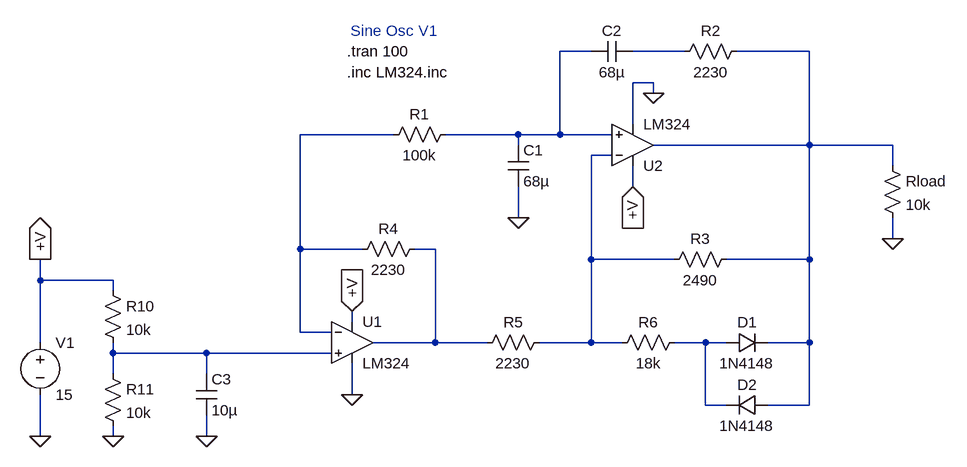
[diagram p0: schematic Sine_Osc_v1.asc]
Sine_Osc_v1.asc, the LTspice schematic file:
Version 4
SHEET 1 880 680
WIRE 144 -400 96 -400
WIRE 288 -400 208 -400
WIRE 480 -400 368 -400
WIRE 240 -352 208 -352
WIRE 240 -336 240 -352
WIRE 208 -288 208 -352
WIRE -160 -272 -304 -272
WIRE 32 -272 -80 -272
WIRE 96 -272 96 -400
WIRE 96 -272 32 -272
WIRE 176 -272 96 -272
WIRE 32 -256 32 -272
WIRE 480 -256 480 -400
WIRE 480 -256 240 -256
WIRE 608 -256 480 -256
WIRE 176 -240 144 -240
WIRE 608 -224 608 -256
WIRE 208 -192 208 -224
WIRE 32 -144 32 -192
WIRE 608 -112 608 -144
WIRE -304 -96 -304 -272
WIRE -208 -96 -304 -96
WIRE -96 -96 -128 -96
WIRE 144 -80 144 -240
WIRE 272 -80 144 -80
WIRE 480 -80 480 -256
WIRE 480 -80 352 -80
WIRE -704 -48 -704 -80
WIRE -592 -48 -704 -48
WIRE -592 -32 -592 -48
WIRE -224 16 -224 0
WIRE -304 32 -304 -96
WIRE -256 32 -304 32
WIRE -704 48 -704 -48
WIRE -96 48 -96 -96
WIRE -96 48 -192 48
WIRE -16 48 -96 48
WIRE 144 48 144 -80
WIRE 144 48 64 48
WIRE 192 48 144 48
WIRE 320 48 272 48
WIRE 352 48 320 48
WIRE 480 48 480 -80
WIRE 480 48 416 48
WIRE -592 64 -592 48
WIRE -448 64 -592 64
WIRE -256 64 -448 64
WIRE -592 96 -592 64
WIRE -448 96 -448 64
WIRE -224 128 -224 80
WIRE 320 144 320 48
WIRE 352 144 320 144
WIRE 480 144 480 48
WIRE 480 144 416 144
WIRE -704 192 -704 128
WIRE -592 192 -592 176
WIRE -448 192 -448 160
FLAG -704 192 0
FLAG -704 -80 +V
IOPIN -704 -80 Out
FLAG -224 0 +V
IOPIN -224 0 In
FLAG -592 192 0
FLAG -224 128 0
FLAG 32 -144 0
FLAG 208 -192 +V
IOPIN 208 -192 In
FLAG 240 -336 0
FLAG 608 -112 0
FLAG -448 192 0
SYMBOL voltage -704 32 R0
WINDOW 123 0 0 Left 2
WINDOW 39 0 0 Left 2
SYMATTR InstName V1
SYMATTR Value 15
SYMBOL res -32 64 R270
WINDOW 0 32 56 VTop 2
WINDOW 3 0 56 VBottom 2
SYMATTR InstName R5
SYMATTR Value 2230
SYMBOL res -112 -112 R90
WINDOW 0 0 56 VBottom 2
WINDOW 3 32 56 VTop 2
SYMATTR InstName R4
SYMATTR Value 2230
SYMBOL res 288 32 R90
WINDOW 0 0 56 VBottom 2
WINDOW 3 32 56 VTop 2
SYMATTR InstName R6
SYMATTR Value 18k
SYMBOL res -608 -48 R0
SYMATTR InstName R10
SYMATTR Value 10k
SYMBOL res -608 80 R0
SYMATTR InstName R11
SYMATTR Value 10k
SYMBOL Opamps\\opamp2 -224 -16 R0
SYMATTR InstName U1
SYMATTR Value LM324
SYMATTR SpiceModel LM324
SYMBOL res -176 -256 R270
WINDOW 0 32 56 VTop 2
WINDOW 3 0 56 VBottom 2
SYMATTR InstName R1
SYMATTR Value 100k
SYMBOL res 384 -416 R90
WINDOW 0 0 56 VBottom 2
WINDOW 3 32 56 VTop 2
SYMATTR InstName R2
SYMATTR Value 2230
SYMBOL res 592 -240 R0
SYMATTR InstName Rload
SYMATTR Value 10k
SYMBOL Opamps\\opamp2 208 -192 M180
SYMATTR InstName U2
SYMATTR Value LM324
SYMATTR SpiceModel LM324
SYMBOL cap 16 -256 R0
SYMATTR InstName C1
SYMATTR Value 68µ
SYMBOL cap 208 -416 R90
WINDOW 0 0 32 VBottom 2
WINDOW 3 32 32 VTop 2
SYMATTR InstName C2
SYMATTR Value 68µ
SYMBOL res 368 -96 R90
WINDOW 0 0 56 VBottom 2
WINDOW 3 32 56 VTop 2
SYMATTR InstName R3
SYMATTR Value 2490
SYMBOL diode 416 128 R90
WINDOW 0 0 32 VBottom 2
WINDOW 3 32 32 VTop 2
SYMATTR InstName D2
SYMATTR Value 1N4148
SYMBOL diode 352 32 M90
WINDOW 0 0 32 VBottom 2
WINDOW 3 32 32 VTop 2
SYMATTR InstName D1
SYMATTR Value 1N4148
SYMBOL cap -464 96 R0
SYMATTR InstName C3
SYMATTR Value 10µ
TEXT -232 -400 Left 2 !.tran 100
TEXT -160 -416 Bottom 2 ;Sine Osc V1
TEXT -232 -368 Left 2 !.inc LM324.inc

The netlist it stands for:
* Sine_Osc_v1.asc
V1 +V 0 15
R5 N006 N005 2230
R4 N006 N004 2230
R6 N007 N005 18k
R10 +V N008 10k
R11 N008 0 10k
XU1 N008 N004 +V 0 N006 LM324 LM324  ; pins In+ In- V+ V- OUT
R1 N004 N001 100k
R2 N003 N002 2230
Rload N003 0 10k
XU2 N001 N005 +V 0 N003 LM324 LM324  ; pins In+ In- V+ V- OUT
C1 N001 0 68µ
C2 N002 N001 68µ
R3 N003 N005 2490
D2 N003 N007 1N4148
D1 N007 N003 1N4148
C3 N008 0 10µ
.model D D
.lib standard.dio
.tran 100
* Sine Osc V1
.inc LM324.inc
.backanno
.end